# EAGLE design AddBoardv2 (EAGLE 9.4.2)
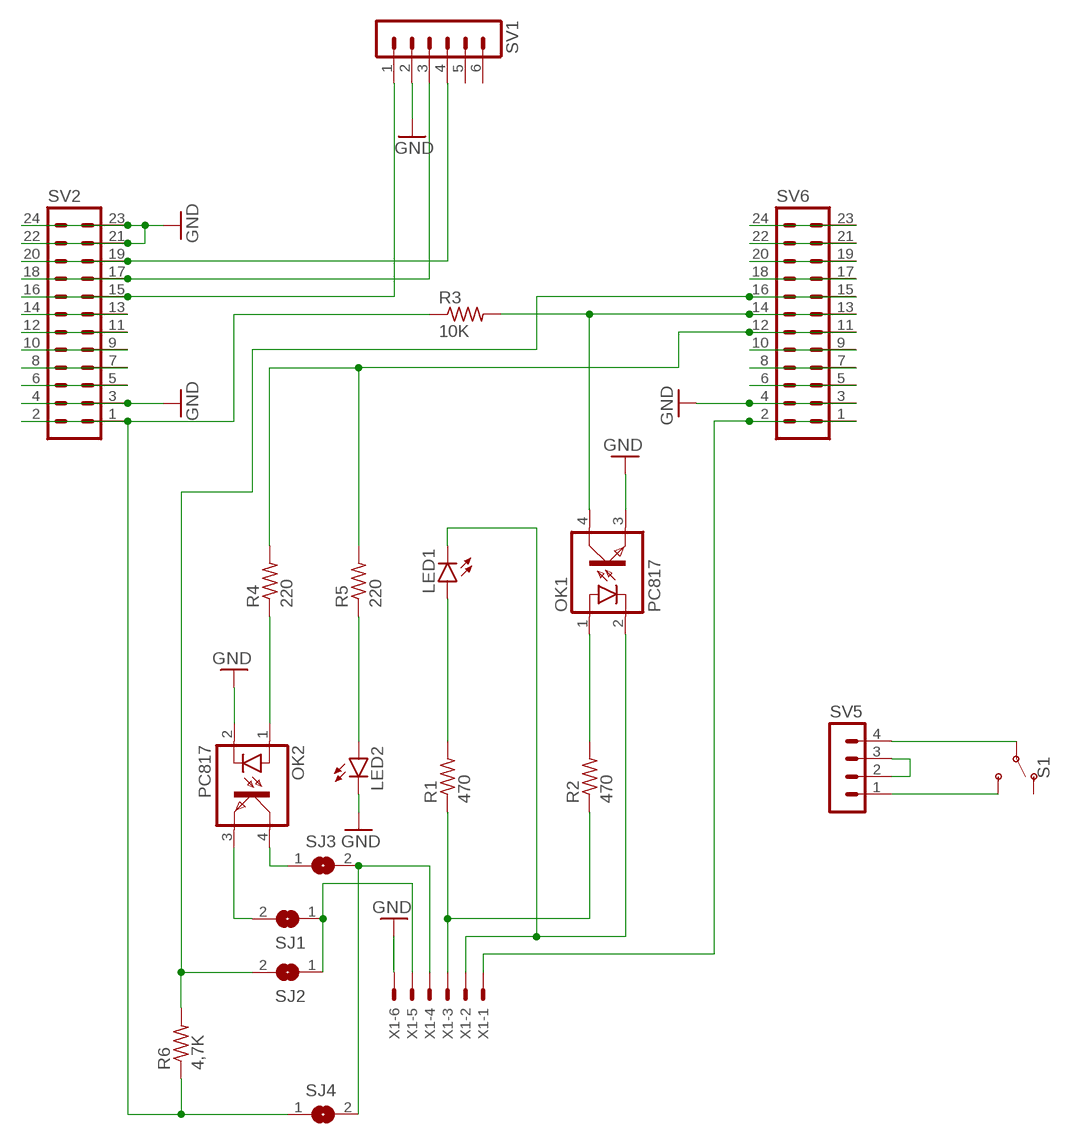
[diagram p0: schematic, sheet 1]

## Parts
LED1  LEDCHIPLED_1206  [CHIPLED_1206]
LED2  LEDCHIPLED_1206  [CHIPLED_1206]
OK1  PC817  [DIL04]
OK2  PC817  [DIL04]
R1  470  ERJ-8GEY0R00V  [RES_1206]
R2  470  ERJ-8GEY0R00V  [RES_1206]
R3  10K  ERJ-8GEY0R00V  [RES_1206]
R4  220  ERJ-8GEY0R00V  [RES_1206]
R5  220  ERJ-8GEY0R00V  [RES_1206]
R6  4,7K  WSLP1206R0500FEA  [RES_1206]
S1  SWITCH-SPDT-SMD-RIGHT-ANGLE  [SWITCH_SPST_SMD_A]
SJ1  SJ  [SJ]
SJ2  SJ  [SJ]
SJ3  SJ  [SJ]
SJ4  SJ  [SJ]
SV1  MA06-1  [MA06-1]
SV2  MA12-2  [MA12-2]
SV5  MA04-1  [MA04-1]
SV6  MA12-2  [MA12-2]
X1  22-23-2061  [22-23-2061]

## Nets
GND: LED2.C OK1.3(EMIT) OK2.2(C) SV1.2 SV2.3 SV2.4 SV2.21 SV2.22 SV2.23 SV2.24 SV6.3 SV6.4 X1.6
N$1: SV1.1 SV2.15 SV2.16
N$2: SV1.3 SV2.17 SV2.18
N$3: SV1.4 SV2.19 SV2.20
N$4: SV6.1 SV6.2 X1.1
N$5: LED1.C OK1.2(C) X1.2
N$6: R1.1 R2.1 X1.3
N$7: OK2.4(COL) SJ3.1
N$8: OK1.1(A) R2.2
N$9: LED1.A R1.2
N$10: R4.2 R5.2 SV6.11 SV6.12
N$11: R3.1 R6.1 SJ4.1 SV2.1 SV2.2
N$12: SJ3.2 SJ4.2 X1.4
N$13: LED2.A R5.1
N$14: OK2.1(A) R4.1
N$15: OK1.4(COL) R3.2 SV6.13 SV6.14
N$16: SV2.5 SV2.6
N$17: SV2.7 SV2.8
N$18: SV2.9 SV2.10
N$19: SV2.11 SV2.12
N$20: SV2.13 SV2.14
N$21: SV6.5 SV6.6
N$22: SV6.7 SV6.8
N$23: SV6.9 SV6.10
N$24: R6.2 SJ2.2 SV6.15 SV6.16
N$26: SV6.19 SV6.20
N$27: SV6.21 SV6.22
N$28: SV6.23 SV6.24
N$29: SV5.2 SV5.3
N$30: S1.2(P) SV5.4
N$31: S1.3(S) SV5.1
N$33: OK2.3(EMIT) SJ1.2
N$34: SJ1.1 SJ2.1 X1.5
N$40: SV6.17 SV6.18
Unconnected: S1.1(O) SV1.5 SV1.6

## Library data of the parts
LED1 LED2 = led:LED: LED OSRAM: - CHIPLED LG R971, LG N971, LY N971, LG Q971, LY Q971, LO R971, LY R971 LH N974, LH R974 LS Q976, LO Q976, LY Q976 LO Q996 - Hyper CHIPLED LW Q18S LB Q993, LB Q99A, LB R99A - SideLED LS A670, LO A670, LY A670, LG A670, LP A670 LB A673, LV A673, LT A673, LW A673 LH A674 LY A675 LS A676, LA A676, LO A676, LY A676, LW A676 LS A679, LY A679, LG A679 - Hyper Micro SIDELED® LS Y876, LA Y876, LO Y876, LY Y876 LT Y87S - SmartLED LW L88C, LW L88S LB L89C, LB L89S, LG L890 LS L89K, LO L89K, LY L89K LS L896, LA L896, LO L896, LY L896 - TOPLED LS T670, LO T670, LY T670, LG T670, LP T670 LSG T670, LSP T670, LSY T670, LOP T670, LYG T670 LG T671, LOG T671, LSG T671 LB T673, LV T673, LT T673, LW T673 LH T674 LS T676, LA T676, LO T676, LY T676, LB T676, LH T676, LSB T676, LW T676 LB T67C, LV T67C, LT T67C, LS T67K, LO T67K, LY T67K, LW E67C LS E67B, LA E67B, LO E67B, LY E67B, LB E67C, LV E67C, LT E67C LW T67C LS T679, LY T679, LG T679 LS T770, LO T770, LY T770, LG T770, LP T770 LB T773, LV T773, LT T773, LW T773 LH T774 LS E675, LA E675, LY E675, LS T675 LS T776, LA T776, LO T776, LY T776, LB T776 LHGB T686 LT T68C, LB T68C - Hyper Mini TOPLED® LB M676 - Mini TOPLED Santana® LG M470 LS M47K, LO M47K, LY M47K Source: http://www.osram.convergy.de LUXEON: - LUMILED® LXK2-PW12-R00, LXK2-PW12-S00, LXK2-PW14-U00, LXK2-PW14-V00 LXK2-PM12-R00, LXK2-PM12-S00, LXK2-PM14-U00 LXK2-PE12-Q00, LXK2-PE12-R00, LXK2-PE12-S00, LXK2-PE14-T00, LXK2-PE14-U00 LXK2-PB12-K00, LXK2-PB12-L00, LXK2-PB12-M00, LXK2-PB14-N00, LXK2-PB14-P00, LXK2-PB14-Q00 LXK2-PR12-L00, LXK2-PR12-M00, LXK2-PR14-Q00, LXK2-PR14-R00 LXK2-PD12-Q00, LXK2-PD12-R00, LXK2-PD12-S00 LXK2-PH12-R00, LXK2-PH12-S00 LXK2-PL12-P00, LXK2-PL12-Q00, LXK2-PL12-R00 Source: www.luxeon.com KINGBRIGHT: KA-3528ASYC Source: www.kingbright.com
OK1 OK2 = optocoupler:PC817: SHARP OPTO COUPLER; MPN: PC817X4J000F; OC_FARNELL: 9707727; OC_NEWARK: 97K7059
R1-R5 = Resistor_Capacitor:ERJ-8GEY0R00V: RES SMD 0 OHM JUMPER 1/4W 1206 Manufacturer's datasheet <https://industrial.panasonic.com/ww/products/resistors/chip-resistors/general-purpose-chip-resistors/thick-film-chip-resistors/ERJ8GEY0R00V>; CREATED_BY: PCBLayout.com; DIGIKEY_PART_NUMBER: P0.0ETR-ND; MANUFACTURER: Panasonic Electronic Components; MPN: ERJ-8GEY0R00V; PACKAGE: SMD 1206
R6 = Resistor_Capacitor:WSLP1206R0500FEA: RES 0.05 OHM 1% 1W 1206 Manufacturer's datasheet <http://www.vishay.com/docs/30122/wslp.pdf>; CREATED_BY: PCBLayout.com; DIGIKEY_PART_NUMBER: WSLP-.05TR-ND; MANUFACTURER: Vishay Dale; MPN: WSLP1206R0500FEA; PACKAGE: SMD 1206
S1 = SparkFun-Switches:SWITCH-SPDT: Single Pole, Double Throw (SPDT) Switch Single-pole, double-throw (SPDT) switch. Variant Overview SMD-AYZ0202 Surface Mount DPDT Switch <https://www.sparkfun.com/products/597> (COM-00597) Used on e.g. LilyPad Arduino USB - ATmega32U4 Board <https://www.sparkfun.com/products/12049> PTH-11.6X4.0MM SPDT Mini Power Switch <https://www.sparkfun.com/products/102> (COM-00102) Used on e.g. SparkFun Simon Says - Through-Hole Soldering Kit <https://www.sparkfun.com/products/10547> (KIT-10547) PTH-11.6X4.0MM-KIT KIT version of SPDT Mini Power Switch - Simplifies soldering by removing tStop of switch pins - only one side can be soldered. PTH-11.6X4.0MM-LOCK LOCK version of SPDT Mini Power Switch - Offset pins hold switch in place for easier soldering. SMD-RIGHT-ANGLE Surface Mount Right Angle Switch <https://www.sparkfun.com/products/10860> (COM-10860) Used on e.g. SparkFun ESP8266 Thing <https://www.sparkfun.com/products/13231>; PROD_ID: SWCH-10651; SF_SKU: COM-10860
SJ1-SJ4 = jumper:SJ: SMD solder JUMPER
SV1 = con-lstb:MA06-1: PIN HEADER; OC_FARNELL: unknown; OC_NEWARK: unknown
SV2 SV6 = con-lstb:MA12-2: PIN HEADER; OC_FARNELL: unknown; OC_NEWARK: unknown
SV5 = con-lstb:MA04-1: PIN HEADER; OC_FARNELL: unknown; OC_NEWARK: unknown
X1 = con-molex:22-23-2061: .100" (2.54mm) Center Header - 6 Pin; MF: MOLEX; MPN: 22-23-2061; OC_FARNELL: 1462922; OC_NEWARK: 27C1933

## Board
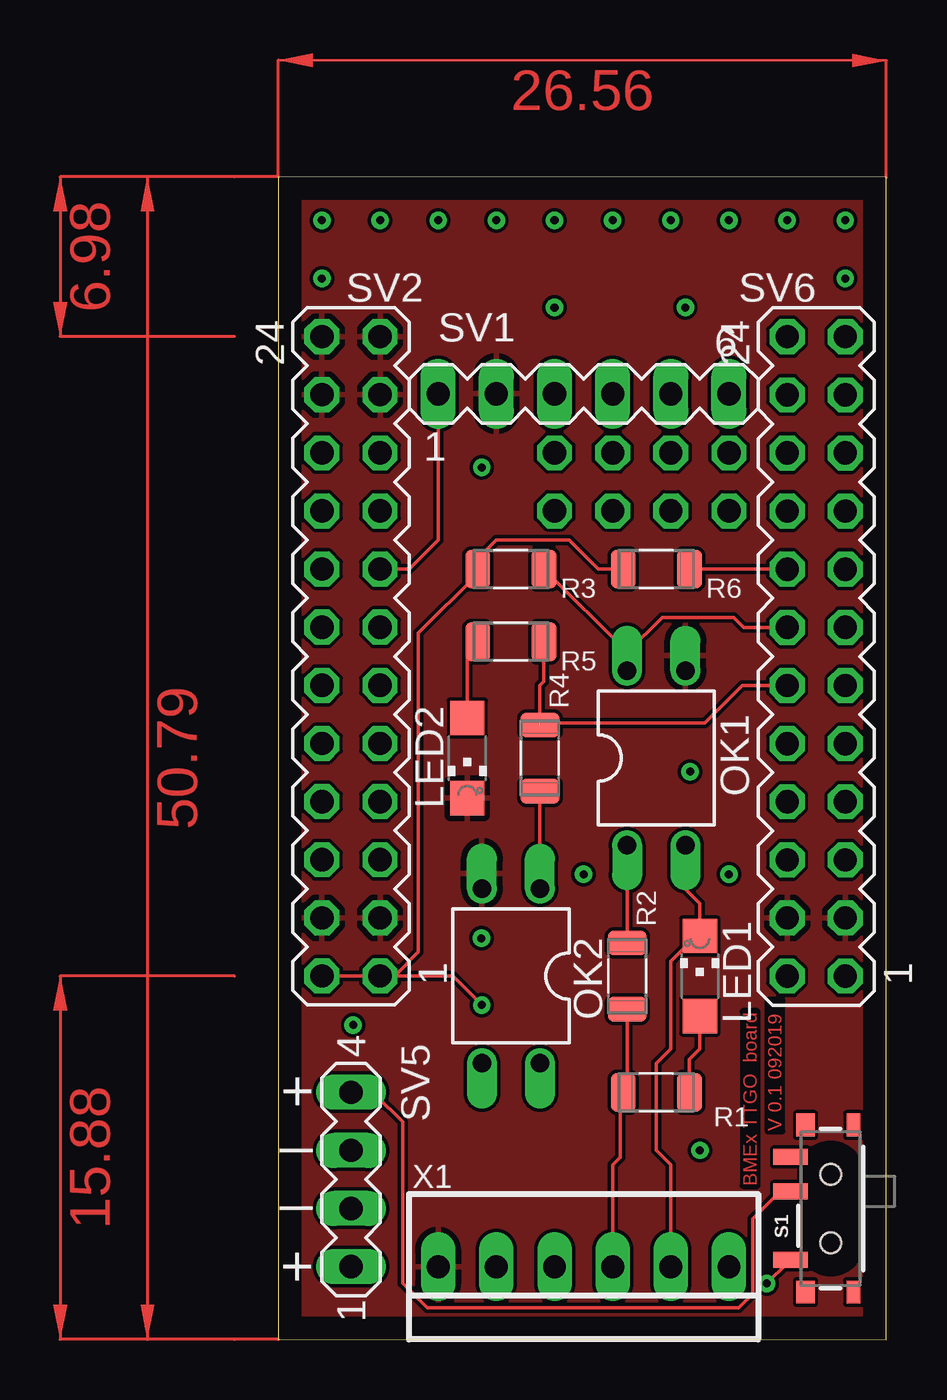
[diagram p1: board, top side]
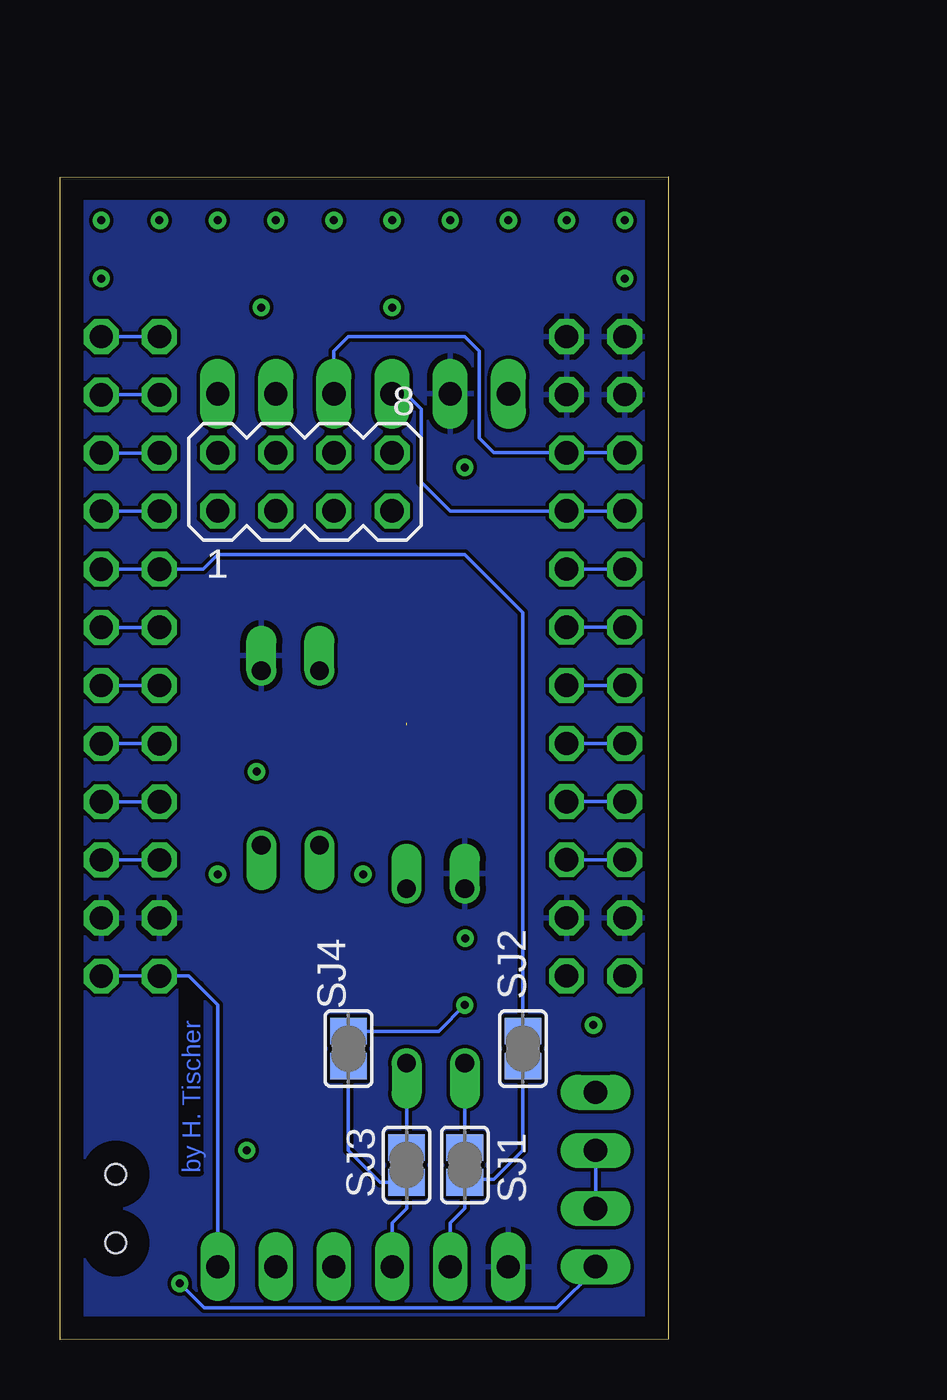
[diagram p2: board, bottom side, seen from below]

Size 26.56 x 50.81 mm. Coordinates in mm from the lower left corner, seen from the top.
Outline: 26.56,50.79 0,50.81 0,0.02 26.56,0 26.56,50.79
Copper layers (1*16): Top 0.035mm / dielectric 1.5mm / Bottom 0.035mm
Design rules "default": minimum track width 6mil, minimum drill 0.35mm, track to track 6mil, track to pad 6mil, pad to pad 6mil, via to via 6mil, smd to smd 6mil, copper to edge 40mil, drill to drill 6mil, minimum pad ring 10mil, minimum via ring 8mil, stop-mask expansion 4mil, vias tented up to drill 0mil, thermal gap 10mil

### Footprints (pad centres in the part's own frame; a part is rotated, then mirrored left to right if it is on the bottom)
CHIPLED_1206 = smd 1.5 x 1.5: A 0,-1.75; C 0,1.75
DIL04 = drill 0.813 offset: 1 -1.27,-3.81; 2 1.27,-3.81; 3 1.27,3.81; 4 -1.27,3.81
RES_1206 = smd 1.08 x 1.68: 1 -1.445,0; 2 1.445,0
SWITCH_SPST_SMD_A = smd 0.7 x 1.5: 1 -2.25,-1.75; 2 -0.75,-1.75; 3 2.25,-1.75 | smd 1 x 0.6: GND1 -3.65,1; GND3 3.65,1 | smd 1 x 0.8: GND2 -3.65,-1.1; GND4 3.65,-1.1 | hole 0.9: -1.5,0; 1.5,0
SJ = smd 1.168 x 1.6: 1 -0.762,0; 2 0.762,0
MA06-1 = drill 1.016 long: 1 -6.35,0; 2 -3.81,0; 3 -1.27,0; 4 1.27,0; 5 3.81,0; 6 6.35,0
MA12-2 = drill 1.016 octagon: 1 -13.97,-1.27; 2 -13.97,1.27; 3 -11.43,-1.27; 4 -11.43,1.27; 5 -8.89,-1.27; 6 -8.89,1.27; 7 -6.35,-1.27; 8 -6.35,1.27; 9 -3.81,-1.27; 10 -3.81,1.27; 11 -1.27,-1.27; 12 -1.27,1.27; 13 1.27,-1.27; 14 1.27,1.27; 15 3.81,-1.27; 16 3.81,1.27; 17 6.35,-1.27; 18 6.35,1.27; 19 8.89,-1.27; 20 8.89,1.27; 21 11.43,-1.27; 22 11.43,1.27; 23 13.97,-1.27; 24 13.97,1.27
MA04-2 = drill 1.016 octagon: 1 -3.81,-1.27; 2 -3.81,1.27; 3 -1.27,-1.27; 4 -1.27,1.27; 5 1.27,-1.27; 6 1.27,1.27; 7 3.81,-1.27; 8 3.81,1.27
MA04-1 = drill 1.016 long: 1 -3.81,0; 2 -1.27,0; 3 1.27,0; 4 3.81,0
22-23-2061 = drill 1 long: 1 -6.35,0; 2 -3.81,0; 3 -1.27,0; 4 1.27,0; 5 3.81,0; 6 6.35,0

### Placement (x,y rotation side)
LED1  18.41,15.89 0 top
LED2  8.26,25.42 180 top
OK1  16.51,25.42 0 top
OK2  10.16,15.89 180 top
R1  16.51,10.81 0 top
R2  15.24,15.89 90 top
R3  10.16,33.67 0 top
R4  11.43,25.42 90 top
R5  10.16,30.5 0 top
R6  16.51,33.67 0 top
S1  24.13,5.73 270 top
SJ1  8.89,7.64 90 bottom
SJ2  6.35,12.72 90 bottom
SJ3  11.43,7.64 270 bottom
SJ4  13.97,12.72 270 bottom
SV1  13.34,41.33 0 top
SV2  3.17,29.86 90 top
SV3  [MA04-2]  15.88,37.48 0 bottom
SV5  3.17,7 90 top
SV6  23.5,29.86 90 top
X1  13.34,3.19 180 top

### Tracks (layer width: path | path; a pad name or v marks a point on that pad's centre or on a via)
GND
  Top 0.152: 8.38,23.64 LED2.C 8.38,23.79
  pour Bottom: 0,0.02 26.67,0.02 26.67,50.82 0,50.82
  pour Top: 0,0.02 26.67,0.02 26.67,50.82 0,50.82
N$1
  Top 0.152: SV1.1 6.99,34.94 5.71,33.67 SV2.15
  Bottom 0.152: SV2.16 SV2.15
N$2
  Bottom 0.152: SV1.3 12.03,41.29 11.43,41.29 10.79,40.66 10.79,37.48 9.53,36.21 SV2.17 SV2.18
N$3
  Bottom 0.152: SV1.4 14.61,43.2 13.97,43.83 8.89,43.83 8.26,43.2 8.26,39.39 7.62,38.75 SV2.19 SV2.20
N$4
  Bottom 0.152: SV6.1 SV6.2 20.95,15.89 19.68,14.62 X1.1
N$5
  Top 0.152: OK1.2 17.78,19.7 18.41,19.07 LED1.C 18.26,17.64 17.14,16.53 17.14,12.72 16.51,12.08 16.51,8.27 17.14,7.64 X1.2
N$6
  Top 0.152: X1.3 14.61,7.64 14.94,7.97 14.94,10.69 R1.1 15.24,10.99 R2.1
N$7
  Bottom 0.152: OK2.4 SJ3.1
N$8
  Top 0.152: OK1.1 R2.2
N$9
  Top 0.152: 18.29,14.04 LED1.A 18.41,12.72 17.95,12.26 R1.2
N$10  (1 unrouted)
  Top 0.152: 11.58,30.5 R5.2 11.61,28.77 11.43,28.59 R4.2 | 11.43,26.94 18.62,26.94 20.26,28.59 SV6.12
  Bottom 0.152: SV6.12 SV6.11
N$11  (via drill 0.35)
  Top 0.152: SV2.1 5.08,15.89 6.12,16.93 6.12,30.88 8.69,33.44 8.69,33.55 R3.1 8.71,34.13 9.53,34.94 12.7,34.94 13.97,33.67 R6.1 | SV2.2 SV2.1 | SV2.1 7.62,15.89 v8.89,14.62
  Bottom 0.152: SJ4.1 10.03,13.48 v8.89,14.62
N$12
  Bottom 0.152: X1.4 12.06,5.1 11.43,5.73 SJ3.2 12.57,6.88 13.97,8.27 SJ4.2
N$13
  Top 0.152: R5.1 8.26,30.5 LED2.A
N$14
  Top 0.152: OK2.1 R4.1
N$15
  Top 0.152: 15.24,30.04 R3.2 | SV6.14 20.32,31.13 19.89,31.57 16.76,31.57 15.24,30.04 | 15.24,30.04 OK1.4
  Bottom 0.152: SV6.14 SV6.13
N$16
  Bottom 0.152: SV2.6 SV2.5
N$17
  Bottom 0.152: SV2.8 SV2.7
N$18
  Bottom 0.152: SV2.10 SV2.9
N$19
  Bottom 0.152: SV2.12 SV2.11
N$20
  Bottom 0.152: SV2.14 SV2.13
N$21
  Bottom 0.152: SV6.6 SV6.5
N$22
  Bottom 0.152: SV6.8 SV6.7
N$23
  Bottom 0.152: SV6.10 SV6.9
N$24
  Top 0.152: SV6.16 R6.2
  Bottom 0.152: SJ2.2 6.35,31.77 8.89,34.31 19.68,34.31 20.32,33.67 SV6.16 SV6.15
N$26
  Bottom 0.152: SV6.20 SV6.19
N$27
  Bottom 0.152: SV6.22 SV6.21
N$28
  Bottom 0.152: SV6.24 SV6.23
N$29
  Bottom 0.152: SV5.3 SV5.2
N$30
  Top 0.152: S1.2 21.93,6.48 20.73,5.28 20.73,2 20.12,1.39 6.5,1.39 5.44,2.46 5.44,9.52 4.27,10.69 3.2,10.69 SV5.4
N$31  (via drill 0.35)
  Top 0.152: v21.34,2.46 22.25,3.37 S1.3
  Bottom 0.152: v21.34,2.46 20.27,1.39 4.88,1.39 3.2,3.07 SV5.1
N$32  (via drill 0.35)
  other vias: 3.27,13.75
N$33
  Bottom 0.152: SJ1.2 OK2.3
N$34
  Bottom 0.152: X1.5 9.53,5.1 8.89,5.73 SJ1.1 8.76,7 7.62,7 6.35,8.27 SJ2.1
N$36  (via drill 0.35)
  other vias: 18.41,8.27
N$37  (via drill 0.35)
  other vias: 13.34,20.34
N$38  (via drill 0.35)
  other vias: 19.68,20.34
N$39  (via drill 0.35)
  other vias: 8.89,38.12
N$40
  Bottom 0.152: SV6.18 SV6.17
N$42  (via drill 0.35)
  other vias: 1.91,48.91
N$43  (via drill 0.35)
  other vias: 1.91,46.37
N$44  (via drill 0.35)
  other vias: 4.45,48.91
N$45  (via drill 0.35)
  other vias: 6.99,48.91
N$46  (via drill 0.35)
  other vias: 9.53,48.91
N$47  (via drill 0.35)
  other vias: 12.06,48.91
N$48  (via drill 0.35)
  other vias: 14.61,48.91
N$49  (via drill 0.35)
  other vias: 17.14,48.91
N$50  (via drill 0.35)
  other vias: 19.68,48.91
N$51  (via drill 0.35)
  other vias: 22.23,48.91
N$52  (via drill 0.35)
  other vias: 24.77,48.91
N$53  (via drill 0.35)
  other vias: 24.77,46.37
N$54  (via drill 0.35)
  other vias: 12.06,45.1
N$55  (via drill 0.35)
  other vias: 17.78,45.1
N$56  (via drill 0.35)
  other vias: 8.87,17.54
N$57  (via drill 0.35)
  other vias: 17.99,24.82
(copper drawn outside any net)
  shapes: Top area x4

### Text on the board
Top: V 0.1 092019 | BMEx TTGO board
Bottom: by H. Tischer
tNames: + | _ | _ | +